# EasyEDA Pro project ProPrj_Practice 4 layer_2025-09-09.epro, board PCB10
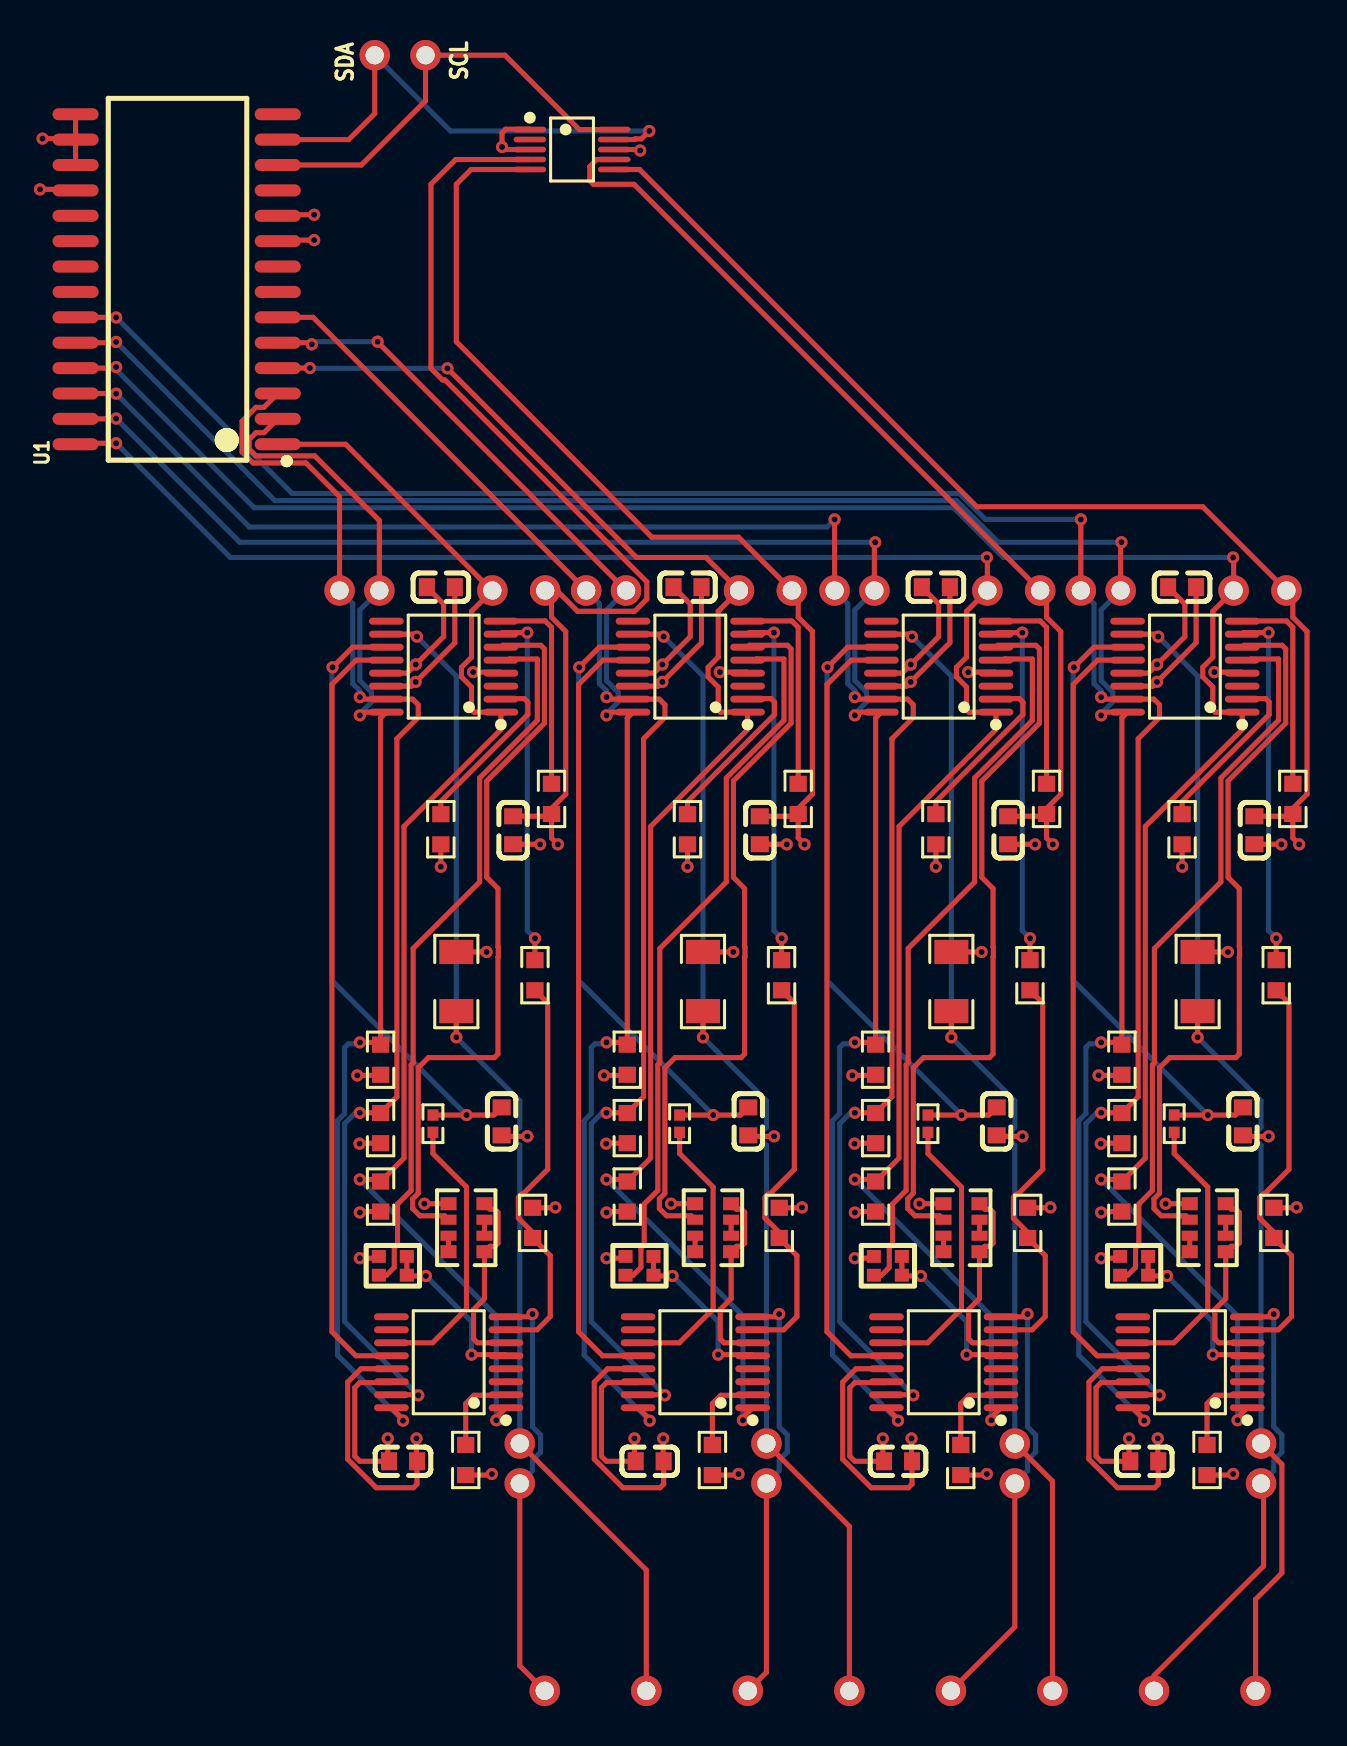
[diagram p15: board, top side]
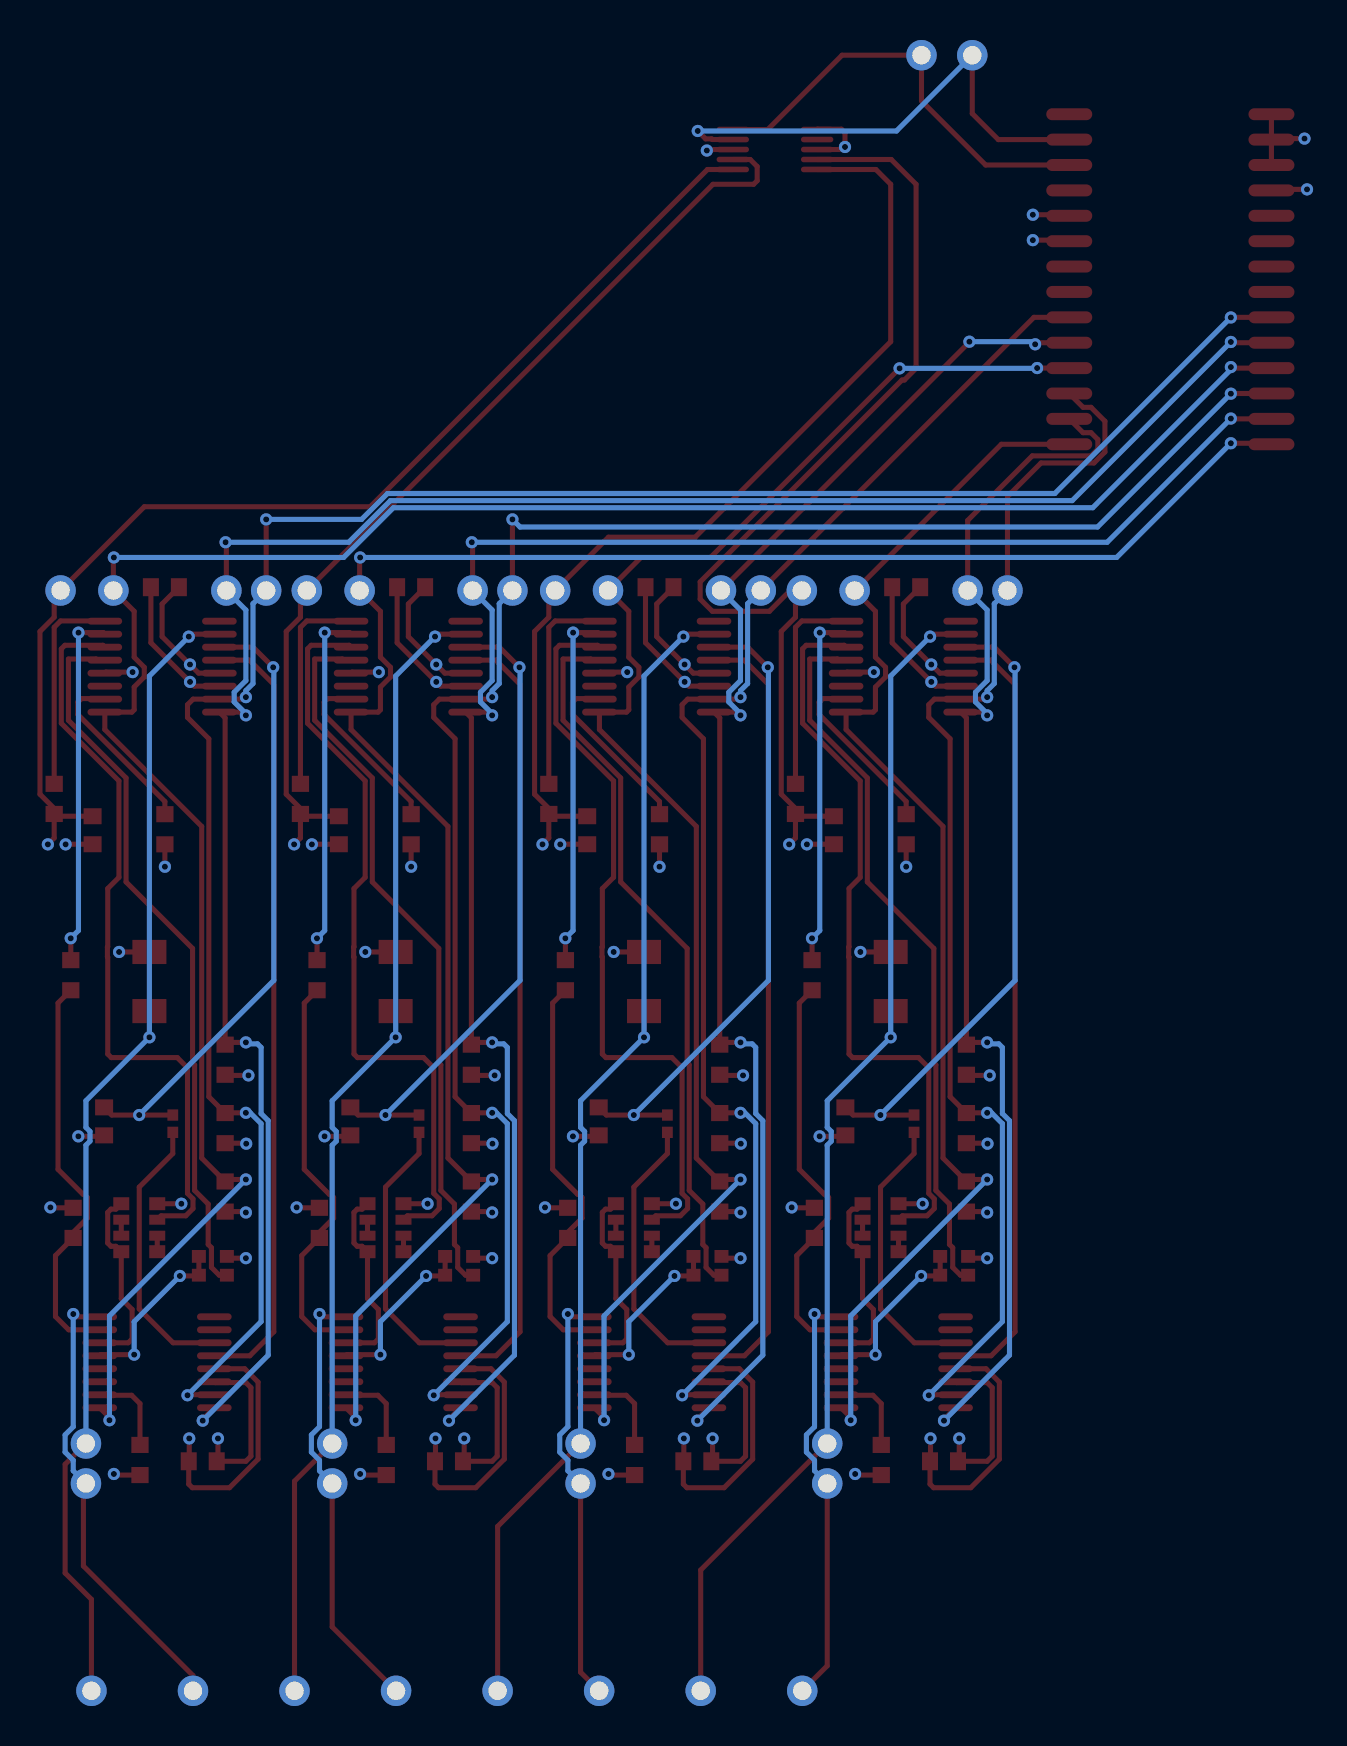
[diagram p16: board, bottom side, seen from below]

No outline. copper layers: Top Layer, Inner1, Inner2, Bottom Layer. Coordinates in mm from the lowest, leftmost part position.
Stack: Top Layer 0.035mm Outer layer thickness 1oz / Dielectric1 0.2104mm 7628 RC49% 8.6mil / Inner1 0.0152mm Inner layer thickness / Dielectric2 1.065mm 1.1mm H/HOZ Copper / Inner2 0.0152mm Inner layer thickness / Dielectric3 0.2104mm 7628 RC49% 8.6mil / Bottom Layer 0.035mm Outer layer thickness 1oz

## Design rules (mm)
template: JLCPCB Capability(Two Layers Board)
spacing copperThickness1oz (default): track to track 0.102, other pairs 0.152 to 0.3
spacing copperThickness2oz: track to track 0.203, other pairs 0.152 to 0.3
track width copperThickness1oz (default): min 0.127, default 0.254, max 2.54
track width copperThickness2oz: min 0.203, default 0.254, max 2.54
differential pair differentialPair (default): width min 0.127, default 0.254, max 2.54; gap min 0.152, default 0.152
via viaSize (default): diameter min 0.5, default 0.61, max 10; hole min 0.3, default 0.305, max 6.3

## Placement (name value [footprint] x y rotation side)
C1  100nF  [C0603]  41.6 43.05 90 top
C1#2  -  [C0603]  53.92 43.05 90 top
C1#3  -  [C0603]  16.83 43.05 90 top
C1#4  -  [C0603]  29.17 43.05 90 top
C2  100nF  [C0603]  41.02 28.49 90 top
C2#2  -  [C0603]  53.34 28.49 90 top
C2#3  -  [C0603]  16.26 28.49 90 top
C2#4  -  [C0603]  28.6 28.49 90 top
C3  -  [C0603]  36.09 11.48 0 top
C3#2  -  [C0603]  48.41 11.48 0 top
C3#3  -  [C0603]  11.32 11.48 0 top
C3#4  -  [C0603]  23.66 11.48 0 top
C4  -  [C0603]  25.56 55.21 0 top
C4#2  -  [C0603]  37.98 55.21 0 top
C4#3  -  [C0603]  50.3 55.21 0 top
C4#4  -  [C0603]  13.22 55.21 0 top
NOREF  -  [Pad_e3283]  45.23 55.04 90 top
NOREF#2  -  [Pad_e980]  28.13 55.04 90 top
NOREF#3  -  [Pad_e62]  18.44 55.04 90 top
NOREF#4  -  [Pad_e11]  18.42 0 90 top
NOREF#5  -  [Pad_e61]  12.45 81.82 90 top
NOREF#6  -  [Pad_e983]  29.51 10.37 90 top
NOREF#7  -  [Pad_e57]  15.79 55.04 90 top
NOREF#8  -  [Pad_e982]  29.51 12.37 90 top
NOREF#9  -  [Pad_e3287]  54.25 12.37 90 top
NOREF#10  -  [Pad_e1895]  34.91 55.04 90 top
NOREF#11  -  [Pad_e981]  30.78 55.04 90 top
NOREF#12  -  [Pad_e13]  23.5 0 90 top
NOREF#13  -  [Pad_e60]  9.91 81.82 90 top
NOREF#14  -  [Pad_e52]  8.15 55.04 90 top
NOREF#15  -  [Pad_e16]  38.74 0 90 top
NOREF#16  -  [Pad_e55]  10.14 55.04 90 top
NOREF#17  -  [Pad_e1899]  41.93 10.37 90 top
NOREF#18  -  [Pad_e979]  22.48 55.04 90 top
NOREF#19  -  [Pad_e1898]  41.93 12.37 90 top
NOREF#20  -  [Pad_e18]  48.9 0 90 top
NOREF#21  -  [Pad_e3284]  47.23 55.04 90 top
NOREF#22  -  [Pad_e63]  17.17 12.37 90 top
NOREF#23  -  [Pad_e1894]  32.91 55.04 90 top
NOREF#24  -  [Pad_e20]  53.98 0 90 top
NOREF#25  -  [Pad_e64]  17.17 10.37 90 top
NOREF#26  -  [Pad_e978]  20.49 55.04 90 top
NOREF#27  -  [Pad_e17]  43.81 0 90 top
NOREF#28  -  [Pad_e3285]  52.88 55.04 90 top
NOREF#29  -  [Pad_e15]  33.66 0 90 top
NOREF#30  -  [Pad_e1896]  40.56 55.04 90 top
NOREF#31  -  [Pad_e1897]  43.2 55.04 90 top
NOREF#32  -  [Pad_e3288]  54.25 10.37 90 top
NOREF#33  -  [Pad_e14]  28.58 0 90 top
NOREF#34  -  [Pad_e3286]  55.52 55.04 90 top
R1  -  [R0603]  43.52 44.62 90 top
R1#2  -  [R0603]  55.84 44.62 90 top
R1#3  -  [R0603]  18.75 44.62 90 top
R1#4  -  [R0603]  31.09 44.62 90 top
R2  -  [R0402]  37.59 28.37 90 top
R2#2  -  [R0402]  49.91 28.37 90 top
R2#3  -  [R0402]  12.82 28.37 90 top
R2#4  -  [R0402]  25.16 28.37 90 top
R3  -  [R1206]  38.76 35.48 90 top
R3#2  -  [R1206]  51.08 35.48 90 top
R3#3  -  [R1206]  13.99 35.48 90 top
R3#4  -  [R1206]  26.33 35.48 90 top
R4  -  [R0603]  39.23 11.55 90 top
R4#2  -  [R0603]  51.55 11.55 90 top
R4#3  -  [R0603]  14.46 11.55 90 top
R4#4  -  [R0603]  26.8 11.55 90 top
R5  -  [R0603]  37.98 43.1 90 top
R5#2  -  [R0603]  50.3 43.1 90 top
R5#3  -  [R0603]  13.22 43.1 90 top
R5#4  -  [R0603]  25.56 43.1 90 top
R6  -  [R0603]  34.97 24.72 90 top
R6#2  -  [R0603]  47.29 24.72 90 top
R6#3  -  [R0603]  10.2 24.72 90 top
R6#4  -  [R0603]  22.54 24.72 90 top
R7  -  [R0603]  34.97 28.15 90 top
R7#2  -  [R0603]  47.29 28.15 90 top
R7#3  -  [R0603]  10.2 28.15 90 top
R7#4  -  [R0603]  22.54 28.15 90 top
R8  -  [R0603]  34.97 31.57 90 top
R8#2  -  [R0603]  47.29 31.57 90 top
R8#3  -  [R0603]  10.2 31.57 90 top
R8#4  -  [R0603]  22.54 31.57 90 top
R9  -  [R0603]  42.57 23.41 90 top
R9#2  -  [R0603]  54.89 23.41 90 top
R9#3  -  [R0603]  17.81 23.41 90 top
R9#4  -  [R0603]  30.15 23.41 90 top
R10  -  [R0603]  30.26 35.8 90 top
R10#2  -  [R0603]  42.69 35.8 90 top
R10#3  -  [R0603]  55.01 35.8 90 top
R10#4  -  [R0603]  17.92 35.8 90 top
U1  MCP23017-E/SO  [TSSOP-16_L5.0-W4.4-P0.65-LS6.4-BL]  38.37 16.43 90 top
U1#2  -  [TSSOP-16_L5.0-W4.4-P0.65-LS6.4-BL]  50.69 16.43 90 top
U1#3  -  [TSSOP-16_L5.0-W4.4-P0.65-LS6.4-BL]  13.61 16.43 90 top
U1#4  -  [TSSOP-16_L5.0-W4.4-P0.65-LS6.4-BL]  25.95 16.43 90 top
U1#5  -  [SOIC-28_L18.0-W7.5-P1.27-LS10.3-BL]  0 70.61 90 top
U2  ADS1115IDGSR  [TSSOP-16_L5.0-W4.4-P0.65-LS6.4-BL]  38.12 51.23 90 top
U2#2  -  [TSSOP-16_L5.0-W4.4-P0.65-LS6.4-BL]  50.44 51.23 90 top
U2#3  -  [TSSOP-16_L5.0-W4.4-P0.65-LS6.4-BL]  13.36 51.23 90 top
U2#4  -  [TSSOP-16_L5.0-W4.4-P0.65-LS6.4-BL]  25.7 51.23 90 top
U2#5  -  [MSOP-10_L3.0-W3.0-P0.50-LS5.0-BL]  19.78 77.1 270 top
U3  -  [RES-ARRAY-SMD_4P-L1.6-W1.5-BL]  35.58 21.26 90 top
U3#2  -  [RES-ARRAY-SMD_4P-L1.6-W1.5-BL]  47.9 21.26 90 top
U3#3  -  [RES-ARRAY-SMD_4P-L1.6-W1.5-BL]  10.82 21.26 90 top
U3#4  -  [RES-ARRAY-SMD_4P-L1.6-W1.5-BL]  23.16 21.26 90 top
U4  -  [RES-ARRAY-SMD_0603-8P-L3.2-W1.6-BL]  39.26 23.17 90 top
U4#2  -  [RES-ARRAY-SMD_0603-8P-L3.2-W1.6-BL]  51.58 23.17 90 top
U4#3  -  [RES-ARRAY-SMD_0603-8P-L3.2-W1.6-BL]  14.5 23.17 90 top
U4#4  -  [RES-ARRAY-SMD_0603-8P-L3.2-W1.6-BL]  26.84 23.17 90 top

## Footprints (pads in the part's own frame, mm; a bottom-side part is the same pattern mirrored in y, then rotated)
C0603
  rect 0.8x0.9 smd: 1(-0.7,0) 2(0.7,0)
MSOP-10_L3.0-W3.0-P0.50-LS5.0-BL
  oval 0.28x1.62 smd: 1(-1,-2.11) 2(-0.5,-2.11) 3(0,-2.11) 4(0.5,-2.11) 5(1,-2.11) 6(1,2.11) 7(0.5,2.11) 8(0,2.11) 9(-0.5,2.11) 10(-1,2.11)
Pad_e11
  round 1.524 hole 0.914: 1(0,0)
Pad_e13
  round 1.524 hole 0.914: 1(0,0)
Pad_e14
  round 1.524 hole 0.914: 2(0,0)
Pad_e15
  round 1.524 hole 0.914: 3(0,0)
Pad_e16
  round 1.524 hole 0.914: 4(0,0)
Pad_e17
  round 1.524 hole 0.914: 5(0,0)
Pad_e18
  round 1.524 hole 0.914: 6(0,0)
Pad_e20
  round 1.524 hole 0.914: 1(0,0)
Pad_e52
  round 1.524 hole 0.914: 1(0,0)
Pad_e55
  round 1.524 hole 0.914: 2(0,0)
Pad_e57
  round 1.524 hole 0.914: 3(0,0)
Pad_e60
  round 1.524 hole 0.914: 1(0,0)
Pad_e61
  round 1.524 hole 0.914: 2(0,0)
Pad_e62
  round 1.524 hole 0.914: 4(0,0)
Pad_e63
  round 1.524 hole 0.914: 1(0,0)
Pad_e64
  round 1.524 hole 0.914: 2(0,0)
Pad_e978
  round 1.524 hole 0.914: 1(0,0)
Pad_e979
  round 1.524 hole 0.914: 2(0,0)
Pad_e980
  round 1.524 hole 0.914: 3(0,0)
Pad_e981
  round 1.524 hole 0.914: 4(0,0)
Pad_e982
  round 1.524 hole 0.914: 1(0,0)
Pad_e983
  round 1.524 hole 0.914: 2(0,0)
Pad_e1894
  round 1.524 hole 0.914: 1(0,0)
Pad_e1895
  round 1.524 hole 0.914: 2(0,0)
Pad_e1896
  round 1.524 hole 0.914: 3(0,0)
Pad_e1897
  round 1.524 hole 0.914: 4(0,0)
Pad_e1898
  round 1.524 hole 0.914: 1(0,0)
Pad_e1899
  round 1.524 hole 0.914: 2(0,0)
Pad_e3283
  round 1.524 hole 0.914: 1(0,0)
Pad_e3284
  round 1.524 hole 0.914: 2(0,0)
Pad_e3285
  round 1.524 hole 0.914: 3(0,0)
Pad_e3286
  round 1.524 hole 0.914: 4(0,0)
Pad_e3287
  round 1.524 hole 0.914: 1(0,0)
Pad_e3288
  round 1.524 hole 0.914: 2(0,0)
R0402
  rect 0.566x0.54 smd: 1(-0.433,0) 2(0.433,0)
R0603
  rect 0.806x0.864 smd: 1(-0.753,0) 2(0.753,0)
R1206
  rect 1.208x1.701 smd: 1(-1.479,0) 2(1.479,0)
RES-ARRAY-SMD_4P-L1.6-W1.5-BL
  rect 0.64x0.7 smd: 1(-0.47,-0.7) 2(-0.47,0.7) 3(0.47,-0.7) 4(0.47,0.7)
RES-ARRAY-SMD_0603-8P-L3.2-W1.6-BL
  rect 0.65x0.8 smd: 1(-1.2,-0.9) 4(1.2,-0.9) 5(1.2,0.9) 8(-1.2,0.9)
  rect 0.5x0.8 smd: 2(-0.4,-0.9) 3(0.4,-0.9) 6(0.4,0.9) 7(-0.4,0.9)
SOIC-28_L18.0-W7.5-P1.27-LS10.3-BL
  oval 0.6x2.3 smd: 1(-8.255,-5.058) 2(-6.985,-5.058) 3(-5.715,-5.058) 4(-4.445,-5.058) 5(-3.175,-5.058) 6(-1.905,-5.058) 7(-0.635,-5.058) 8(0.635,-5.058) 9(1.905,-5.058) 10(3.175,-5.058) 11(4.445,-5.058) 12(5.715,-5.058) 13(6.985,-5.058) 14(8.255,-5.058) 15(8.255,5.058) 16(6.985,5.058) 17(5.715,5.058) 18(4.445,5.058) 19(3.175,5.058) 20(1.905,5.058) 21(0.635,5.058) 22(-0.635,5.058) 23(-1.905,5.058) 24(-3.175,5.058) 25(-4.445,5.058) 26(-5.715,5.058) 27(-6.985,5.058) 28(-8.255,5.058)
TSSOP-16_L5.0-W4.4-P0.65-LS6.4-BL
  oval 0.343x1.732 smd: 1(-2.275,-2.866) 2(-1.625,-2.866) 3(-0.975,-2.866) 4(-0.325,-2.866) 5(0.325,-2.866) 6(0.975,-2.866) 7(1.625,-2.866) 8(2.275,-2.866) 9(2.275,2.866) 10(1.625,2.866) 11(0.975,2.866) 12(0.325,2.866) 13(-0.325,2.866) 14(-0.975,2.866) 15(-1.625,2.866) 16(-2.275,2.866)

## Nets
+5V: C3.2 C3#2.2 C3#3.2 C3#4.2 C4.1 C4#2.1 C4#3.1 C4#4.1 U1.13 U1#2.13 U1#3.13 U1#4.13 U1#5.9 U1#5.18 U2.13 U2#2.13 U2#3.13 U2#4.13 U2#5.8
GND: C1.1 C1#2.1 C1#3.1 C1#4.1 C2.1 C2#2.1 C2#3.1 C2#4.1 C3.1 C3#2.1 C3#3.1 C3#4.1 C4.2 C4#2.2 C4#3.2 C4#4.2 R3.2 R3#2.2 R3#3.2 R3#4.2 R4.1 R4#2.1 R4#3.1 R4#4.1 R5.1 R5#2.1 R5#3.1 R5#4.1 R6.1 R6#2.1 R6#3.1 R6#4.1 R7.1 R7#2.1 R7#3.1 R7#4.1 R8.1 R8#2.1 R8#3.1 R8#4.1 R9.2 R9#2.2 R9#3.2 R9#4.2 U1.14 U1#2.14 U1#3.14 U1#4.14 U1#5.10 U1#5.15 U1#5.16 U1#5.17 U2.4 U2.14 U2#2.4 U2#2.14 U2#3.4 U2#3.14 U2#4.4 U2#4.14 U2#5.1 U2#5.3 U3.4 U3#2.4 U3#3.4 U3#4.4 U4.5 U4#2.5 U4#3.5 U4#4.5
CH1_ADC: C1#3.2 NOREF#3.4 R1#3.1 U2#5.4
CH1_ADDR1: NOREF#7.3 R6#3.2 U1#3.1 U1#5.1 U2#3.1
CH1_ADDR2: NOREF#16.2 R8#3.2 U1#3.16 U1#5.2 U2#3.16
CH1_ADDR3: NOREF#14.1 R7#3.2 U1#3.15 U1#5.3 U2#3.15
CH1_PATCH-PNL-IN-I: NOREF#12.1 NOREF#22.1 R3#3.1 U2#3.10
CH1_PATCH-PNL-IN-V: NOREF#4.1 NOREF#25.2 U1#3.8
CH1_U1EN: R4#3.2 U1#3.2
CH1_U1S2: U1#3.5 U3#3.1 U3#3.3
CH1_U1S3: U1#3.6 U4#3.1 U4#3.4
CH1_U1S4: R9#3.1 R10#4.1 U1#3.7
CH1_U1S5: U1#3.12 U2#3.12
CH1_U1S6: R2#3.1 U1#3.11
CH1_U2D: R1#3.2 U2#3.8
CH1_U2EN: R5#3.2 U2#3.2
CH1_U2S2: U2#3.5 U3#3.2
CH1_U2S3: U2#3.6 U4#3.6
CH1_U2S4: R10#4.2 U2#3.7
CH1_U2S6: C2#3.2 R2#3.2 U2#3.11
CH1_U4A: U4#3.7 U4#3.8
CH1_U4B: U4#3.2 U4#3.3
CH2_ADC: C1#4.2 NOREF#11.4 R1#4.1 U2#5.5
CH2_ADDR1: NOREF#2.3 R6#4.2 U1#4.1 U1#5.4 U2#4.1
CH2_ADDR2: NOREF#18.2 R8#4.2 U1#4.16 U1#5.5 U2#4.16
CH2_ADDR3: NOREF#26.1 R7#4.2 U1#4.15 U1#5.6 U2#4.15
CH2_PATCH-PNL-IN-I: NOREF#8.1 NOREF#29.3 R3#4.1 U2#4.10
CH2_PATCH-PNL-IN-V: NOREF#6.2 NOREF#33.2 U1#4.8
CH2_U1EN: R4#4.2 U1#4.2
CH2_U1S2: U1#4.5 U3#4.1 U3#4.3
CH2_U1S3: U1#4.6 U4#4.1 U4#4.4
CH2_U1S4: R9#4.1 R10.1 U1#4.7
CH2_U1S5: U1#4.12 U2#4.12
CH2_U1S6: R2#4.1 U1#4.11
CH2_U2D: R1#4.2 U2#4.8
CH2_U2EN: R5#4.2 U2#4.2
CH2_U2S2: U2#4.5 U3#4.2
CH2_U2S3: U2#4.6 U4#4.6
CH2_U2S4: R10.2 U2#4.7
CH2_U2S6: C2#4.2 R2#4.2 U2#4.11
CH2_U4B: U4#4.2 U4#4.3
CH2P_U4A: U4#4.7 U4#4.8
CH3_ADC: C1.2 NOREF#31.4 R1.1 U2#5.7
CH3_ADDR1: NOREF#30.3 R6.2 U1.1 U1#5.28 U2.1
CH3_ADDR2: NOREF#10.2 R8.2 U1.16 U1#5.27 U2.16
CH3_ADDR3: NOREF#23.1 R7.2 U1.15 U1#5.26 U2.15
CH3_PATCH-PNL-IN-I: NOREF#19.1 NOREF#27.5 R3.1 U2.10
CH3_PATCH-PNL-IN-V: NOREF#15.4 NOREF#17.2 U1.8
CH3_U1EN: R4.2 U1.2
CH3_U1S2: U1.5 U3.1 U3.3
CH3_U1S3: U1.6 U4.1 U4.4
CH3_U1S4: R9.1 R10#2.1 U1.7
CH3_U1S5: U1.12 U2.12
CH3_U1S6: R2.1 U1.11
CH3_U2D: R1.2 U2.8
CH3_U2EN: R5.2 U2.2
CH3_U2S2: U2.5 U3.2
CH3_U2S3: U2.6 U4.6
CH3_U2S4: R10#2.2 U2.7
CH3_U2S6: C2.2 R2.2 U2.11
CH3_U4A: U4.7 U4.8
CH3_U4B: U4.2 U4.3
CH4_ADC: C1#2.2 NOREF#34.4 R1#2.1 U2#5.6
CH4_ADDR1: NOREF#28.3 R6#2.2 U1#2.1 U1#5.25 U2#2.1
CH4_ADDR2: NOREF#21.2 R8#2.2 U1#2.16 U1#5.24 U2#2.16
CH4_ADDR3: NOREF.1 R7#2.2 U1#2.15 U1#5.23 U2#2.15
CH4_PATCH-PNL-IN-I: NOREF#9.1 NOREF#24.1 R3#2.1 U2#2.10
CH4_PATCH-PNL-IN-V: NOREF#20.6 NOREF#32.2 U1#2.8
CH4_U1EN: R4#2.2 U1#2.2
CH4_U1S2: U1#2.5 U3#2.1 U3#2.3
CH4_U1S3: U1#2.6 U4#2.1 U4#2.4
CH4_U1S4: R9#2.1 R10#3.1 U1#2.7
CH4_U1S5: U1#2.12 U2#2.12
CH4_U1S6: R2#2.1 U1#2.11
CH4_U2D: R1#2.2 U2#2.8
CH4_U2EN: R5#2.2 U2#2.2
CH4_U2S2: U2#2.5 U3#2.2
CH4_U2S3: U2#2.6 U4#2.6
CH4_U2S4: R10#3.2 U2#2.7
CH4_U2S6: C2#2.2 R2#2.2 U2#2.11
CH4_U4A: U4#2.7 U4#2.8
CH4_U4B: U4#2.2 U4#2.3
SCL: NOREF#5.2 U1#5.12 U2#5.10
SDA: NOREF#13.1 U1#5.13 U2#5.9

Pads without a net: U1 3 4 9 10; U1#2 3 4 9 10; U1#3 3 4 9 10; U1#4 3 4 9 10; U1#5 7 8 11 14 19 20 21 22; U2 3 9; U2#2 3 9; U2#3 3 9; U2#4 3 9; U2#5 2

## Via types
v1: diameter 0.61, hole 0.305, Top Layer to Bottom Layer, 159 vias

## Routing (per net, layer and track width the routed paths; a pad name or vN(x,y) marks a point on that pad's centre or on a via; arc(x,y) is an arc through that point)
+5V: length 81.7
  Top Layer w0.254: v1(49.08,12.62) 49.08,11.51 C3#2.2 49.11,10.34 48.93,10.16 47.07,10.16 45.64,11.59 45.64,15.44 46.3,16.11 U1#2.13 ; v1(12,12.62) 12,11.51 C3#3.2 12.02,10.34 11.84,10.16 9.98,10.16 8.55,11.59 8.55,15.44 9.22,16.11 U1#3.13 ; U1#4.13 21.56,16.11 20.89,15.44 20.89,11.59 22.32,10.16 24.18,10.16 24.36,10.34 C3#4.2 24.34,11.51 v1(24.34,12.62) ; 22.83,50.91 23.87,50.91 v1(24.3,51.34) 25.7,52.73 25.7,54.37 C4.1 ; C4#2.1 38.12,54.37 38.12,52.73 v1(36.73,51.34) 36.29,50.91 U2.13 ; U2#5.8 23.14,77.1 v1(23.19,77.05) ; U1.13 33.99,16.11 33.32,15.44 33.32,11.59 34.75,10.16 36.61,10.16 36.79,10.34 C3.2 36.76,11.51 v1(36.76,12.62) ; 10.49,50.91 11.53,50.91 v1(11.96,51.34) 13.36,52.73 13.36,54.37 C4#4.1 ; v1(6.88,72.57) 5.11,72.57 U1#5.9 ; v1(-6.84,75.11) -5.11,75.11 U1#5.18 ; C4#3.1 50.44,54.37 50.44,52.73 v1(49.05,51.34) 48.61,50.91 47.57,50.91
GND: length 130.3
  Top Layer w0.254: R8.1 34.94,30.79 v1(33.8,30.79) ; v1(9.16,21.64) 10.03,21.64 U3#3.4 ; v1(43.71,24.18) 43.69,24.16 R9.2 ; C4.2 26.26,52.43 v1(24.3,50.47) 24.09,50.26 22.83,50.26 ; C1#4.1 30.52,42.35 v1(30.52,42.34) ; C4#2.2 38.68,52.43 v1(36.72,50.47) 36.51,50.26 U2.14 ; 28.6,27.79 28.65,27.74 v1(29.89,27.74) ; v1(9.15,27.37) 9.17,27.39 R7#3.1 ; v1(9.16,23.93) 9.21,23.97 R6#3.1 ; R7#4.1 21.51,27.39 v1(21.49,27.37) ; v1(46.25,21.64) 47.11,21.64 47.2,21.73 ; 41.02,27.79 41.07,27.74 v1(42.31,27.74) ; v1(46.12,30.79) 47.26,30.79 R8#2.1 ; U1.14 35.47,15.42 33.93,15.42 33.68,15.16 33.68,11.74 33.93,11.48 C3.1 35.33,11.54 v1(35.33,12.62) ; v1(27.17,50.96) 28.51,50.96 28.56,50.91 ; v1(14.83,50.96) 16.17,50.96 U2#3.4 ; R6#4.1 21.55,23.97 v1(21.5,23.93) ; v1(17.55,27.74) 16.31,27.74 16.26,27.79 ; v1(18.18,42.34) 18.18,42.35 C1#3.1 ; v1(15.77,10.85) 15.71,10.79 R4#3.1 ; 10.49,50.26 11.75,50.26 v1(11.96,50.47) 13.92,52.43 C4#4.2 ; U1#5.16 -5.11,77.65 v1(-6.71,77.65) ; U1#5.16 U1#5.15 ; U1#5.16 U1#5.17 ; v1(42.95,42.34) 42.94,42.35 C1.1 ; v1(33.91,27.37) 33.94,27.39 R7.1 ; R4#2.1 52.8,10.79 v1(52.85,10.85) ; U2#2.4 53.25,50.96 v1(51.92,50.96) ; C4#3.2 51,52.43 v1(49.04,50.47) 48.83,50.26 47.57,50.26 ; v1(40.27,36.96) R3.2 ; v1(37.98,41.22) R5.1 ; v1(46.23,27.37) 46.26,27.39 R7#2.1 ; 53.34,27.79 53.39,27.74 v1(54.63,27.74) ; U1#5.10 5.11,73.84 v1(6.88,73.84) ; U1#2.14 47.79,15.42 46.25,15.42 45.99,15.16 45.99,11.74 46.25,11.48 C3#2.1 47.65,11.54 v1(47.65,12.62) ; v1(31.28,24.18) 31.26,24.16 R9#4.2 ; U4#3.5 v1(12.39,24.37) ; U2.4 40.93,50.96 v1(39.6,50.96) ; v1(9.04,30.79) 10.17,30.79 R8#3.1 ; v1(33.93,21.64) 34.79,21.64 U3.4 ; v1(25.56,41.22) R5#4.1 ; C1#2.1 55.26,42.35 v1(55.27,42.34) ; U2#5.1 17.65,78.12 16.46,78.12 16.28,77.94 v1(16.28,77.23) 16.4,77.1 U2#5.3 ; U1#3.14 10.7,15.42 9.16,15.42 8.91,15.16 8.91,11.74 9.16,11.48 10.62,11.48 10.56,11.54 v1(10.56,12.62) ; R4#4.1 28.05,10.79 v1(28.11,10.85) ; v1(50.3,41.22) R5#2.1 ; v1(22.9,12.62) 22.9,11.54 C3#4.1 21.5,11.48 21.25,11.74 21.25,15.16 21.5,15.42 23.04,15.42 U1#4.14 ; v1(21.5,21.64) 22.37,21.64 22.46,21.73 ; R6#2.1 46.29,23.97 v1(46.25,23.93) ; v1(52.59,36.96) R3#2.2 ; R8#4.1 22.51,30.79 v1(21.38,30.79) ; v1(13.22,41.22) R5#3.1 ; R4.1 40.48,10.79 v1(40.53,10.85) ; v1(15.51,36.96) R3#3.2 ; v1(33.93,23.93) 33.97,23.97 R6.1 ; v1(18.94,24.18) 18.92,24.16 R9#3.2 ; R9#2.2 56.01,24.16 v1(56.03,24.18) ; v1(27.85,36.96) R3#4.2 ; U4#4.5 v1(24.73,24.37) ; U4#2.5 v1(49.48,24.37) ; U4.5 v1(37.16,24.37)
CH1_ADC: length 52
  Top Layer w0.254: R1#3.1 18.75,44.14 19.47,44.85 19.47,52.99 18.75,53.7 18.75,54.72 NOREF#3.4 19.02,55.04 20.06,54 22.91,54 23.52,54.61 23.52,55.47 13.42,65.57 13.3,65.57 12.72,66.15 12.72,75.36 13.96,76.6 U2#5.4 ; R1#3.1 18.64,43.75 C1#3.2 ; R1#3.1 18.75,42.66 v1(19.07,42.34)
CH1_ADDR1: length 64.8
  Top Layer w0.254: v1(15.99,13.54) 15.99,13.67 U1#3.1 ; U1#5.1 8.45,62.36 15.77,55.04 NOREF#7.3 14.75,54 14.75,51.71 14.25,51.2 14.25,50.72 14.75,50.21 14.75,49.07 14.87,48.96 U2#3.1 16.22,48.09 11.37,43.24 11.37,26.65 R6#3.2 10.1,25.58 v1(9.16,25.58)
  Bottom Layer w0.254: v1(9.16,25.58) 15.99,18.75 v1(15.99,13.54)
CH1_ADDR2: length 62.1
  Top Layer w0.254: v1(11.32,13.51) 11.32,13.58 U1#3.16 ; v1(9.16,32.44) 10.09,32.44 R8#3.2 10.2,48.67 10.49,48.96 9.33,48.96 v1(9.16,48.8) ; NOREF#16.2 10.14,58.54 6.91,61.78 3.97,61.78 3.63,62.12 3.63,62.6 3.97,62.94 4.37,62.94 U1#5.2
  Bottom Layer w0.254: v1(11.32,13.51) 8.05,16.79 8.05,28.52 8.4,28.88 8.4,32.18 8.58,32.36 9.09,32.36 v1(9.16,32.44) ; NOREF#16.2 9.16,54.07 9.16,50.53 9.75,49.95 9.75,49.47 9.16,48.88 v1(9.16,48.8)
CH1_ADDR3: length 62.9
  Top Layer w0.254: U1#3.15 12.06,14.81 v1(12.09,14.78) ; v1(9.16,28.91) 10.19,28.91 R7#3.2 11.02,29.72 11.02,47.62 12.09,48.69 12.09,49.33 11.81,49.61 9.27,49.61 v1(9.16,49.71) ; U1#5.3 4.37,64.21 3.97,64.21 3.27,63.51 3.27,61.97 3.82,61.42 6.47,61.42 8.15,59.74 NOREF#14.1
  Bottom Layer w0.254: v1(9.16,28.91) 8.94,28.91 8.4,28.37 8.4,18.47 v1(12.09,14.78) ; v1(9.16,49.71) 9.16,50.03 8.81,50.39 8.81,54.38 NOREF#14.1
CH1_PATCH-PNL-IN-I: length 60.5
  Top Layer w0.254: NOREF#12.1 23.5,6.04 NOREF#22.1 ; 10.49,52.86 11.9,52.86 v1(12.02,52.73) ; v1(13.99,32.69) R3#3.1
  Bottom Layer w0.254: v1(12.02,52.73) 13.99,50.76 v1(13.99,32.69) 17.17,29.52 17.17,28.18 16.96,27.98 16.96,27.5 17.17,27.29 NOREF#22.1
CH1_PATCH-PNL-IN-V: length 21.3
  Top Layer w0.254: v1(17.8,18.85) 17.66,18.71 U1#3.8 ; NOREF#25.2 17.17,1.25 NOREF#4.1
  Bottom Layer w0.254: NOREF#25.2 17.8,11.01 17.8,11.53 18.21,11.94 18.21,12.8 17.8,13.21 v1(17.8,18.85)
CH1_U1EN: length 4.3
  Top Layer w0.254: 14.46,12.3 14.46,14.37 14.88,14.78 16.45,14.78 U1#3.2
CH1_U1S2: length 8.5
  Top Layer w0.254: v1(12.47,20.75) 11.55,20.75 U3#3.1 U3#3.3 ; U1#3.5 16.42,16.82 v1(14.75,16.82)
  Bottom Layer w0.254: v1(12.47,20.75) 14.75,18.47 v1(14.75,16.82)
CH1_U1S3: length 9.5
  Top Layer w0.254: U4#3.4 15.67,24.09 15.91,24.09 16.08,23.93 16.08,22.4 15.91,22.24 15.67,22.24 U4#3.1 15.4,19.62 14.85,19.08 14.85,17.6 15.05,17.41 U1#3.6
CH1_U1S4: length 20.4
  Top Layer w0.254: U1#3.7 18.03,18.06 18.69,18.72 18.69,21.77 R9#3.1 17.81,22.93 17.1,23.64 17.1,24.68 17.26,24.84 17.32,24.84 18.56,26.09 18.56,34.41 R10#4.1
CH1_U1S5: length 39.1
  Top Layer w0.254: U1#3.12 8.97,16.76 7.77,17.96 7.77,50.34 8.98,51.56 10.49,51.56
CH1_U1S6: length 14
  Top Layer w0.254: R2#3.1 12.82,26.88 14.5,25.2 14.5,19.1 12.81,17.41 U1#3.11
CH1_U2D: length 10.5
  Top Layer w0.254: R1#3.2 18.75,53.2 18.44,53.52 16.23,53.52 U2#3.8
CH1_U2EN: length 8.8
  Top Layer w0.254: R5#3.2 13.22,44.48 17.57,48.84 17.57,49.45 17.39,49.63 16.25,49.63 U2#3.2
CH1_U2S2: length 36.2
  Top Layer w0.254: U3#3.2 10.5,20.79 10.89,21.18 10.89,22.17 11.05,22.33 11.05,24.35 11.73,25.03 11.73,31.31 11.83,31.42 11.83,37.14 15.16,40.46 15.16,45.66 18.04,48.55 18.04,51.61 16.66,51.61 16.6,51.56 U2#3.5
CH1_U2S3: length 37.4
  Top Layer w0.254: U2#3.6 16.31,52.3 18.22,52.3 18.4,52.12 18.4,48.4 15.51,45.52 15.51,40.69 16.08,40.13 16.08,37.22 16.09,37.2 16.09,36.72 16.08,36.7 16.08,31.85 15.9,31.67 12.59,31.67 12.09,31.17 12.09,24.88 11.81,24.61 11.81,24.12 12.17,23.76 13.4,23.76 U4#3.6
CH1_U2S4: length 17.9
  Top Layer w0.254: R10#4.2 17.92,37.64 v1(17.93,37.64) ; v1(17.54,52.93) 16.3,52.93 U2#3.7
  Bottom Layer w0.254: v1(17.54,52.93) 17.54,38.03 v1(17.93,37.64)
CH1_U2S6: length 31.9
  Top Layer w0.254: v1(7.8,51.2) 8.81,52.21 10.49,52.21 ; R2#3.2 v1(14.5,28.8) 15.87,28.8 C2#3.2
  Bottom Layer w0.254: v1(7.8,51.2) 7.77,51.17 7.77,35.54 v1(14.5,28.8)
CH1_U4A: length 0.8
  Top Layer w0.254: U4#3.7 U4#3.8
CH1_U4B: length 0.8
  Top Layer w0.254: U4#3.3 U4#3.2
CH2_ADC: length 49.3
  Top Layer w0.254: R1#4.1 31.09,42.66 v1(31.41,42.34) ; R1#4.1 30.98,43.75 C1#4.2 ; R1#4.1 31.09,44.14 31.81,44.85 31.81,52.99 31.09,53.7 31.09,54.72 NOREF#11.4 28.11,57.71 23.77,57.71 13.99,67.49 13.99,75.36 14.73,76.1 U2#5.5
CH2_ADDR1: length 78.8
  Top Layer w0.254: U1#5.4 5.06,66.17 v1(6.66,66.17) ; v1(13.55,66.15) 23.01,56.69 26.48,56.69 NOREF#2.3 27.09,54 27.09,51.71 26.59,51.2 26.59,50.72 27.09,50.21 27.09,49.07 27.21,48.96 28.56,48.96 28.56,48.09 23.71,43.24 23.71,26.65 R6#4.2 22.44,25.58 v1(21.5,25.58) ; U1#4.1 28.33,13.67 v1(28.33,13.54)
  Bottom Layer w0.254: v1(21.5,25.58) 28.33,18.75 v1(28.33,13.54) ; v1(6.66,66.17) 6.68,66.15 v1(13.55,66.15)
CH2_ADDR2: length 71
  Top Layer w0.254: v1(10.05,67.49) 10.05,67.47 NOREF#18.2 ; v1(23.66,13.51) 23.66,13.58 U1#4.16 ; v1(21.5,48.8) 21.67,48.96 22.83,48.96 22.54,48.67 R8#4.2 22.43,32.44 v1(21.5,32.44) ; U1#5.5 6.68,67.44 v1(6.76,67.36)
  Bottom Layer w0.254: v1(23.66,13.51) 20.39,16.79 20.39,28.52 20.74,28.88 20.74,32.18 20.92,32.36 21.43,32.36 v1(21.5,32.44) ; v1(6.76,67.36) 6.89,67.49 v1(10.05,67.49) ; v1(21.5,48.8) 21.5,48.88 22.09,49.47 22.09,49.95 21.5,50.53 21.5,54.07 NOREF#18.2
CH2_ADDR3: length 69.6
  Top Layer w0.254: U1#4.15 24.4,14.81 v1(24.43,14.78) ; U1#5.6 6.82,68.71 NOREF#26.1 ; v1(21.5,49.71) 21.61,49.61 24.15,49.61 24.43,49.33 24.43,48.69 23.36,47.62 23.36,29.72 R7#4.2 22.53,28.91 v1(21.5,28.91)
  Bottom Layer w0.254: v1(24.43,14.78) 20.74,18.47 20.74,28.37 21.28,28.91 v1(21.5,28.91) ; NOREF#26.1 21.15,54.38 21.15,50.39 21.5,50.03 v1(21.5,49.71)
CH2_PATCH-PNL-IN-I: length 59.6
  Top Layer w0.254: 22.83,52.86 24.24,52.86 v1(24.36,52.73) ; NOREF#29.3 33.66,8.22 NOREF#8.1 ; v1(26.33,32.69) R3#4.1
  Bottom Layer w0.254: NOREF#8.1 29.51,27.29 29.3,27.5 29.3,27.98 29.51,28.18 29.51,29.52 v1(26.33,32.69) 26.33,50.76 v1(24.36,52.73)
CH2_PATCH-PNL-IN-V: length 21.2
  Top Layer w0.254: NOREF#33.2 29.51,0.93 NOREF#6.2 ; U1#4.8 30,18.71 v1(30.14,18.85)
  Bottom Layer w0.254: v1(30.14,18.85) 30.14,13.21 30.55,12.8 30.55,11.94 30.14,11.53 30.14,11.01 NOREF#6.2
CH2_U1EN: length 4.3
  Top Layer w0.254: 26.8,12.3 26.8,14.37 27.22,14.78 28.79,14.78 U1#4.2
CH2_U1S2: length 8.5
  Top Layer w0.254: U3#4.3 U3#4.1 23.89,20.75 v1(24.81,20.75) ; v1(27.09,16.82) 28.76,16.82 U1#4.5
  Bottom Layer w0.254: v1(24.81,20.75) 27.09,18.47 v1(27.09,16.82)
CH2_U1S3: length 9.5
  Top Layer w0.254: U1#4.6 27.39,17.41 27.19,17.6 27.19,19.08 27.74,19.62 U4#4.1 28.01,22.24 28.25,22.24 28.42,22.4 28.42,23.93 28.25,24.09 28.01,24.09 U4#4.4
CH2_U1S4: length 20.4
  Top Layer w0.254: U1#4.7 30.37,18.06 31.03,18.72 31.03,21.77 R9#4.1 30.15,22.93 29.44,23.64 29.44,24.68 29.6,24.84 29.66,24.84 30.9,26.09 30.9,34.41 R10.1
CH2_U1S5: length 39.1
  Top Layer w0.254: 22.83,51.56 21.32,51.56 20.11,50.34 20.11,17.96 21.31,16.76 U1#4.12
CH2_U1S6: length 14
  Top Layer w0.254: U1#4.11 25.15,17.41 26.84,19.1 26.84,25.2 25.16,26.88 R2#4.1
CH2_U2D: length 10.5
  Top Layer w0.254: 28.56,53.51 28.57,53.52 30.78,53.52 31.09,53.2 R1#4.2
CH2_U2EN: length 8.8
  Top Layer w0.254: R5#4.2 25.56,44.48 29.91,48.84 29.91,49.45 29.73,49.63 28.59,49.63 28.56,49.61
CH2_U2S2: length 36.2
  Top Layer w0.254: 22.46,20.79 22.84,20.79 23.23,21.18 23.23,22.17 23.39,22.33 23.39,24.35 24.07,25.03 24.07,31.31 24.17,31.42 24.17,37.14 27.5,40.46 27.5,45.66 30.38,48.55 30.38,51.61 29,51.61 28.94,51.56 28.56,51.56
CH2_U2S3: length 37.4
  Top Layer w0.254: 28.56,52.21 28.65,52.3 30.56,52.3 30.74,52.12 30.74,48.4 27.85,45.52 27.85,40.69 28.42,40.13 28.42,37.22 28.43,37.2 28.43,36.72 28.42,36.7 28.42,31.85 28.24,31.67 24.93,31.67 24.43,31.17 24.43,24.88 24.15,24.61 24.15,24.12 24.51,23.76 25.74,23.76 U4#4.6
CH2_U2S4: length 17.9
  Top Layer w0.254: R10.2 30.26,37.64 v1(30.27,37.64) ; 28.56,52.86 28.64,52.93 v1(29.88,52.93)
  Bottom Layer w0.254: v1(30.27,37.64) 29.88,38.03 v1(29.88,52.93)
CH2_U2S6: length 31.9
  Top Layer w0.254: C2#4.2 28.21,28.8 v1(26.84,28.8) R2#4.2 ; 22.83,52.21 21.15,52.21 v1(20.14,51.2)
  Bottom Layer w0.254: v1(26.84,28.8) 20.11,35.54 20.11,51.17 v1(20.14,51.2)
CH2_U4B: length 0.8
  Top Layer w0.254: U4#4.3 U4#4.2
CH2P_U4A: length 0.8
  Top Layer w0.254: U4#4.7 U4#4.8
CH3_ADC: length 48.6
  Top Layer w0.254: R1.1 43.52,42.66 v1(43.84,42.34) ; R1.1 43.41,43.75 C1.2 ; R1.1 43.52,44.14 44.23,44.85 44.23,52.99 43.52,53.7 43.52,54.72 NOREF#31.4 22.88,75.36 20.85,75.36 20.67,75.54 20.67,76.25 21.02,76.6 U2#5.7
CH3_ADDR1: length 100.7
  Top Layer w0.254: U1#5.28 -5.01,62.41 v1(-3.03,62.41) ; v1(40.53,56.69) 40.56,56.67 NOREF#30.3 39.52,54 39.52,51.71 39.01,51.2 39.01,50.72 39.52,50.21 39.52,49.07 39.63,48.96 U2.1 40.99,48.09 36.14,43.24 36.14,26.65 R6.2 34.87,25.58 v1(33.93,25.58) ; U1.1 40.76,13.67 v1(40.76,13.54)
  Bottom Layer w0.254: v1(33.93,25.58) 40.76,18.75 v1(40.76,13.54) ; v1(40.53,56.69) 2.69,56.69 v1(-3.03,62.41)
CH3_ADDR2: length 93.3
  Top Layer w0.254: v1(33.93,48.8) 34.09,48.96 U2.16 34.97,48.67 R8.2 34.85,32.44 v1(33.93,32.44) ; U1#5.27 -3.04,63.63 v1(-3.03,63.64) ; U1.16 36.09,13.58 v1(36.09,13.51) ; NOREF#10.2 34.91,57.42 v1(34.95,57.46)
  Bottom Layer w0.254: v1(36.09,13.51) 32.81,16.79 32.81,28.52 33.17,28.88 33.17,32.18 33.35,32.36 33.86,32.36 v1(33.93,32.44) ; v1(34.95,57.46) 3.16,57.46 v1(-3.03,63.64) ; v1(33.93,48.8) 33.93,48.88 34.51,49.47 34.51,49.95 33.93,50.53 33.93,54.07 NOREF#10.2
CH3_ADDR3: length 93
  Top Layer w0.254: U1#5.26 -3.04,64.9 v1(-3.03,64.89) ; v1(33.93,28.91) 34.95,28.91 R7.2 35.78,29.72 35.78,47.62 36.85,48.69 36.85,49.33 36.57,49.61 U2.15 34.03,49.61 v1(33.93,49.71) ; U1.15 36.82,14.81 v1(36.85,14.78) ; NOREF#23.1 v1(32.91,58.6)
  Bottom Layer w0.254: v1(-3.03,64.89) 3.64,58.22 32.53,58.22 v1(32.91,58.6) ; NOREF#23.1 33.57,54.38 33.57,50.39 33.93,50.03 v1(33.93,49.71) ; v1(33.93,28.91) 33.71,28.91 33.17,28.37 33.17,18.47 v1(36.85,14.78)
CH3_PATCH-PNL-IN-I: length 58.7
  Top Layer w0.254: NOREF#19.1 43.81,10.49 NOREF#27.5 ; U2.10 36.66,52.86 v1(36.79,52.73) ; v1(38.76,32.69) 38.76,34
  Bottom Layer w0.254: v1(36.79,52.73) 38.76,50.76 v1(38.76,32.69) 41.93,29.52 41.93,28.18 41.73,27.98 41.73,27.5 41.93,27.29 NOREF#19.1
CH3_PATCH-PNL-IN-V: length 22.2
  Top Layer w0.254: v1(42.57,18.85) 42.43,18.71 U1.8 ; NOREF#17.2 41.93,3.19 NOREF#15.4
  Bottom Layer w0.254: NOREF#17.2 42.57,11.01 42.57,11.53 42.97,11.94 42.97,12.8 42.57,13.21 v1(42.57,18.85)
CH3_U1EN: length 4.3
  Top Layer w0.254: U1.2 41.21,14.78 39.64,14.78 39.23,14.37 39.23,12.3
CH3_U1S2: length 8.5
  Top Layer w0.254: v1(37.23,20.75) 36.32,20.75 U3.1 U3.3 ; v1(39.52,16.82) 41.18,16.82 U1.5
  Bottom Layer w0.254: v1(39.52,16.82) 39.52,18.47 v1(37.23,20.75)
CH3_U1S3: length 9.5
  Top Layer w0.254: 40.16,24.37 40.43,24.09 40.68,24.09 40.84,23.93 40.84,22.4 40.68,22.24 40.43,22.24 40.16,21.97 40.16,19.62 39.62,19.08 39.62,17.6 39.81,17.41 U1.6
CH3_U1S4: length 20.4
  Top Layer w0.254: U1.7 42.79,18.06 43.45,18.72 43.45,21.77 R9.1 42.57,22.93 41.86,23.64 41.86,24.68 42.02,24.84 42.08,24.84 43.33,26.09 43.33,34.41 R10#2.1
CH3_U1S5: length 39.1
  Top Layer w0.254: U2.12 33.75,51.56 32.53,50.34 32.53,17.96 33.73,16.76 U1.12
CH3_U1S6: length 14
  Top Layer w0.254: R2.1 37.59,26.88 39.26,25.2 39.26,19.1 37.57,17.41 U1.11
CH3_U2D: length 10.5
  Top Layer w0.254: R1.2 43.52,53.2 43.2,53.52 41,53.52 U2.8
CH3_U2EN: length 8.8
  Top Layer w0.254: R5.2 37.98,44.48 42.34,48.84 42.34,49.45 42.16,49.63 41.01,49.63 U2.2
CH3_U2S2: length 36.2
  Top Layer w0.254: U2.5 41.37,51.56 41.42,51.61 42.81,51.61 42.81,48.55 39.92,45.66 39.92,40.46 36.6,37.14 36.6,31.42 36.49,31.31 36.49,25.03 35.81,24.35 35.81,22.33 35.65,22.17 35.65,21.18 35.26,20.79 U3.2
CH3_U2S3: length 37.4
  Top Layer w0.254: U2.6 41.08,52.3 42.98,52.3 43.16,52.12 43.16,48.4 40.28,45.52 40.28,40.69 40.84,40.13 40.84,37.22 40.86,37.2 40.86,36.72 40.84,36.7 40.84,31.85 40.66,31.67 37.36,31.67 36.85,31.17 36.85,24.88 36.57,24.61 36.57,24.12 36.94,23.76 38.17,23.76 U4.6
CH3_U2S4: length 17.9
  Top Layer w0.254: v1(42.3,52.93) 41.06,52.93 U2.7 ; v1(42.69,37.64) 42.69,37.64 R10#2.2
  Bottom Layer w0.254: v1(42.3,52.93) 42.3,38.03 v1(42.69,37.64)
CH3_U2S6: length 31.9
  Top Layer w0.254: U2.11 33.57,52.21 v1(32.56,51.2) ; C2.2 40.64,28.8 v1(39.27,28.8) R2.2
  Bottom Layer w0.254: v1(39.27,28.8) 32.53,35.54 32.53,51.17 v1(32.56,51.2)
CH3_U4A: length 0.8
  Top Layer w0.254: U4.7 U4.8
CH3_U4B: length 0.8
  Top Layer w0.254: 40.16,23.57 40.16,22.77
CH4_ADC: length 57.9
  Top Layer w0.254: C1#2.2 55.72,43.75 R1#2.1 ; R1#2.1 55.84,42.66 v1(56.15,42.34) ; R1#2.1 55.84,44.14 56.55,44.85 56.55,52.99 55.84,53.7 55.84,54.72 NOREF#34.4 51.33,59.23 40.03,59.23 23.16,76.1 U2#5.6
CH4_ADDR1: length 114.7
  Top Layer w0.254: U1#2.1 53.07,13.67 v1(53.07,13.54) ; v1(52.85,56.69) 52.88,56.67 NOREF#28.3 51.84,54 51.84,51.71 51.33,51.2 51.33,50.72 51.84,50.21 51.84,49.07 51.95,48.96 U2#2.1 53.31,48.09 48.46,43.24 48.46,26.65 R6#2.2 47.19,25.58 v1(46.25,25.58) ; U1#5.25 -3.08,66.17 v1(-3.03,66.22)
  Bottom Layer w0.254: v1(-3.03,66.22) -3.03,66.09 3.88,59.18 38.87,59.18 41.36,56.69 v1(52.85,56.69) ; v1(46.25,25.58) 53.07,18.75 v1(53.07,13.54)
CH4_ADDR2: length 107.2
  Top Layer w0.254: NOREF#21.2 47.23,57.42 v1(47.26,57.46) ; U1#2.16 48.41,13.58 v1(48.41,13.51) ; v1(46.25,48.8) 46.41,48.96 47.57,48.96 47.29,48.67 R8#2.2 47.17,32.44 v1(46.25,32.44) ; v1(-3.03,67.47) -3.07,67.44 U1#5.24
  Bottom Layer w0.254: v1(46.25,32.44) 46.17,32.36 45.67,32.36 45.49,32.18 45.49,28.88 45.13,28.52 45.13,16.79 v1(48.41,13.51) ; v1(-3.03,67.47) 4.91,59.54 39.02,59.54 41.1,57.46 v1(47.26,57.46) ; v1(46.25,48.8) 46.25,48.88 46.83,49.47 46.83,49.95 46.25,50.53 46.25,54.07 NOREF#21.2
CH4_ADDR3: length 106.6
  Top Layer w0.254: v1(46.25,49.71) 46.35,49.61 48.89,49.61 49.17,49.33 49.17,48.69 48.1,47.62 48.1,29.72 R7#2.2 47.27,28.91 v1(46.25,28.91) ; U1#2.15 49.14,14.81 v1(49.17,14.78) ; NOREF.1 v1(45.23,58.6) ; U1#5.23 -3.03,68.71 v1(-3.03,68.7)
  Bottom Layer w0.254: v1(46.25,28.91) 46.03,28.91 45.49,28.37 45.49,18.47 v1(49.17,14.78) ; v1(46.25,49.71) 46.25,50.03 45.89,50.39 45.89,54.38 NOREF.1 ; v1(45.23,58.6) 40.46,58.6 39.17,59.89 5.78,59.89 v1(-3.03,68.7)
CH4_PATCH-PNL-IN-I: length 58.9
  Top Layer w0.254: NOREF#9.1 55.29,11.33 55.29,5.89 53.98,4.58 NOREF#24.1 ; v1(51.07,32.69) R3#2.1 ; 47.57,52.86 48.98,52.86 v1(49.1,52.73)
  Bottom Layer w0.254: NOREF#9.1 54.25,27.29 54.05,27.5 54.05,27.98 54.25,28.18 54.25,29.52 v1(51.07,32.69) 51.07,50.76 v1(49.1,52.73)
CH4_PATCH-PNL-IN-V: length 23.2
  Top Layer w0.254: NOREF#20.6 48.9,0.76 54.38,6.24 54.38,10.24 NOREF#32.2 ; v1(54.88,18.85) 54.75,18.71 U1#2.8
  Bottom Layer w0.254: v1(54.88,18.85) 54.88,13.21 55.29,12.8 55.29,11.94 54.88,11.53 54.88,11.01 NOREF#32.2
CH4_U1EN: length 4.3
  Top Layer w0.254: U1#2.2 53.53,14.78 51.96,14.78 51.55,14.37 51.55,12.3
CH4_U1S2: length 8.5
  Top Layer w0.254: v1(51.84,16.82) 53.5,16.82 U1#2.5 ; v1(49.55,20.75) 48.64,20.75 U3#2.1 U3#2.3
  Bottom Layer w0.254: v1(49.55,20.75) 51.84,18.47 v1(51.84,16.82)
CH4_U1S3: length 9.5
  Top Layer w0.254: U4#2.4 52.75,24.09 53,24.09 53.16,23.93 53.16,22.4 53,22.24 52.75,22.24 U4#2.1 52.48,19.62 51.94,19.08 51.94,17.6 52.13,17.41 U1#2.6
CH4_U1S4: length 20.4
  Top Layer w0.254: R10#3.1 55.65,34.41 55.65,26.09 54.4,24.84 54.34,24.84 54.18,24.68 54.18,23.64 54.89,22.93 R9#2.1 55.77,21.77 55.77,18.72 55.11,18.06 U1#2.7
CH4_U1S5: length 39.1
  Top Layer w0.254: 47.57,51.56 46.07,51.56 44.85,50.34 44.85,17.96 46.05,16.76 U1#2.12
CH4_U1S6: length 14
  Top Layer w0.254: R2#2.1 49.91,26.88 51.58,25.2 51.58,19.1 49.89,17.41 U1#2.11
CH4_U2D: length 10.5
  Top Layer w0.254: U2#2.8 53.32,53.52 55.52,53.52 55.84,53.2 R1#2.2
CH4_U2EN: length 8.8
  Top Layer w0.254: R5#2.2 50.3,44.48 54.66,48.84 54.66,49.45 54.48,49.63 53.33,49.63 U2#2.2
CH4_U2S2: length 36.2
  Top Layer w0.254: 47.2,20.79 47.58,20.79 47.97,21.18 47.97,22.17 48.13,22.33 48.13,24.35 48.81,25.03 48.81,31.31 48.92,31.42 48.92,37.14 52.24,40.46 52.24,45.66 55.13,48.55 55.13,51.61 53.74,51.61 53.69,51.56 U2#2.5
CH4_U2S3: length 37.4
  Top Layer w0.254: U2#2.6 53.4,52.3 55.3,52.3 55.48,52.12 55.48,48.4 52.6,45.52 52.6,40.69 53.16,40.13 53.16,37.22 53.18,37.2 53.18,36.72 53.16,36.7 53.16,31.85 52.98,31.67 49.68,31.67 49.17,31.17 49.17,24.88 48.89,24.61 48.89,24.12 49.26,23.76 50.49,23.76 U4#2.6
CH4_U2S4: length 17.9
  Top Layer w0.254: U2#2.7 53.38,52.93 v1(54.62,52.93) ; R10#3.2 55.01,37.64 v1(55.01,37.64)
  Bottom Layer w0.254: v1(54.62,52.93) 54.62,38.03 v1(55.01,37.64)
CH4_U2S6: length 31.9
  Top Layer w0.254: 47.57,52.21 45.89,52.21 v1(44.88,51.2) ; C2#2.2 52.96,28.8 v1(51.59,28.8) R2#2.2
  Bottom Layer w0.254: v1(44.88,51.2) 44.85,51.17 44.85,35.54 v1(51.59,28.8)
CH4_U4A: length 0.8
  Top Layer w0.254: U4#2.7 U4#2.8
CH4_U4B: length 0.8
  Top Layer w0.254: U4#2.3 U4#2.2
SCL: length 22
  Top Layer w0.254: U1#5.12 9.24,76.33 12.45,79.54 NOREF#5.2 16.42,81.82 20.14,78.1 U2#5.10
SDA: length 25.5
  Top Layer w0.254: U1#5.13 8.61,77.6 9.91,78.9 NOREF#13.1 ; U2#5.9 22.91,77.6 22.95,77.63 23.25,77.63 v1(23.64,78.03)
  Bottom Layer w0.254: v1(23.64,78.03) 13.7,78.03 NOREF#13.1

## Copper pours and planes (outline as drawn; the poured copper is in the pictures)
+5V on Inner2: -19.03,88.06 90.19,88.06 90.19,-17.6 -19.03,-17.6
GND on Inner1: -10.39,83.74 75.71,83.74 75.71,-11.25 -10.39,-11.25

## Text on the board
Top Silkscreen Layer: SDA | SCL
